# EAGLE design MM4_r0 (EAGLE 6.1)
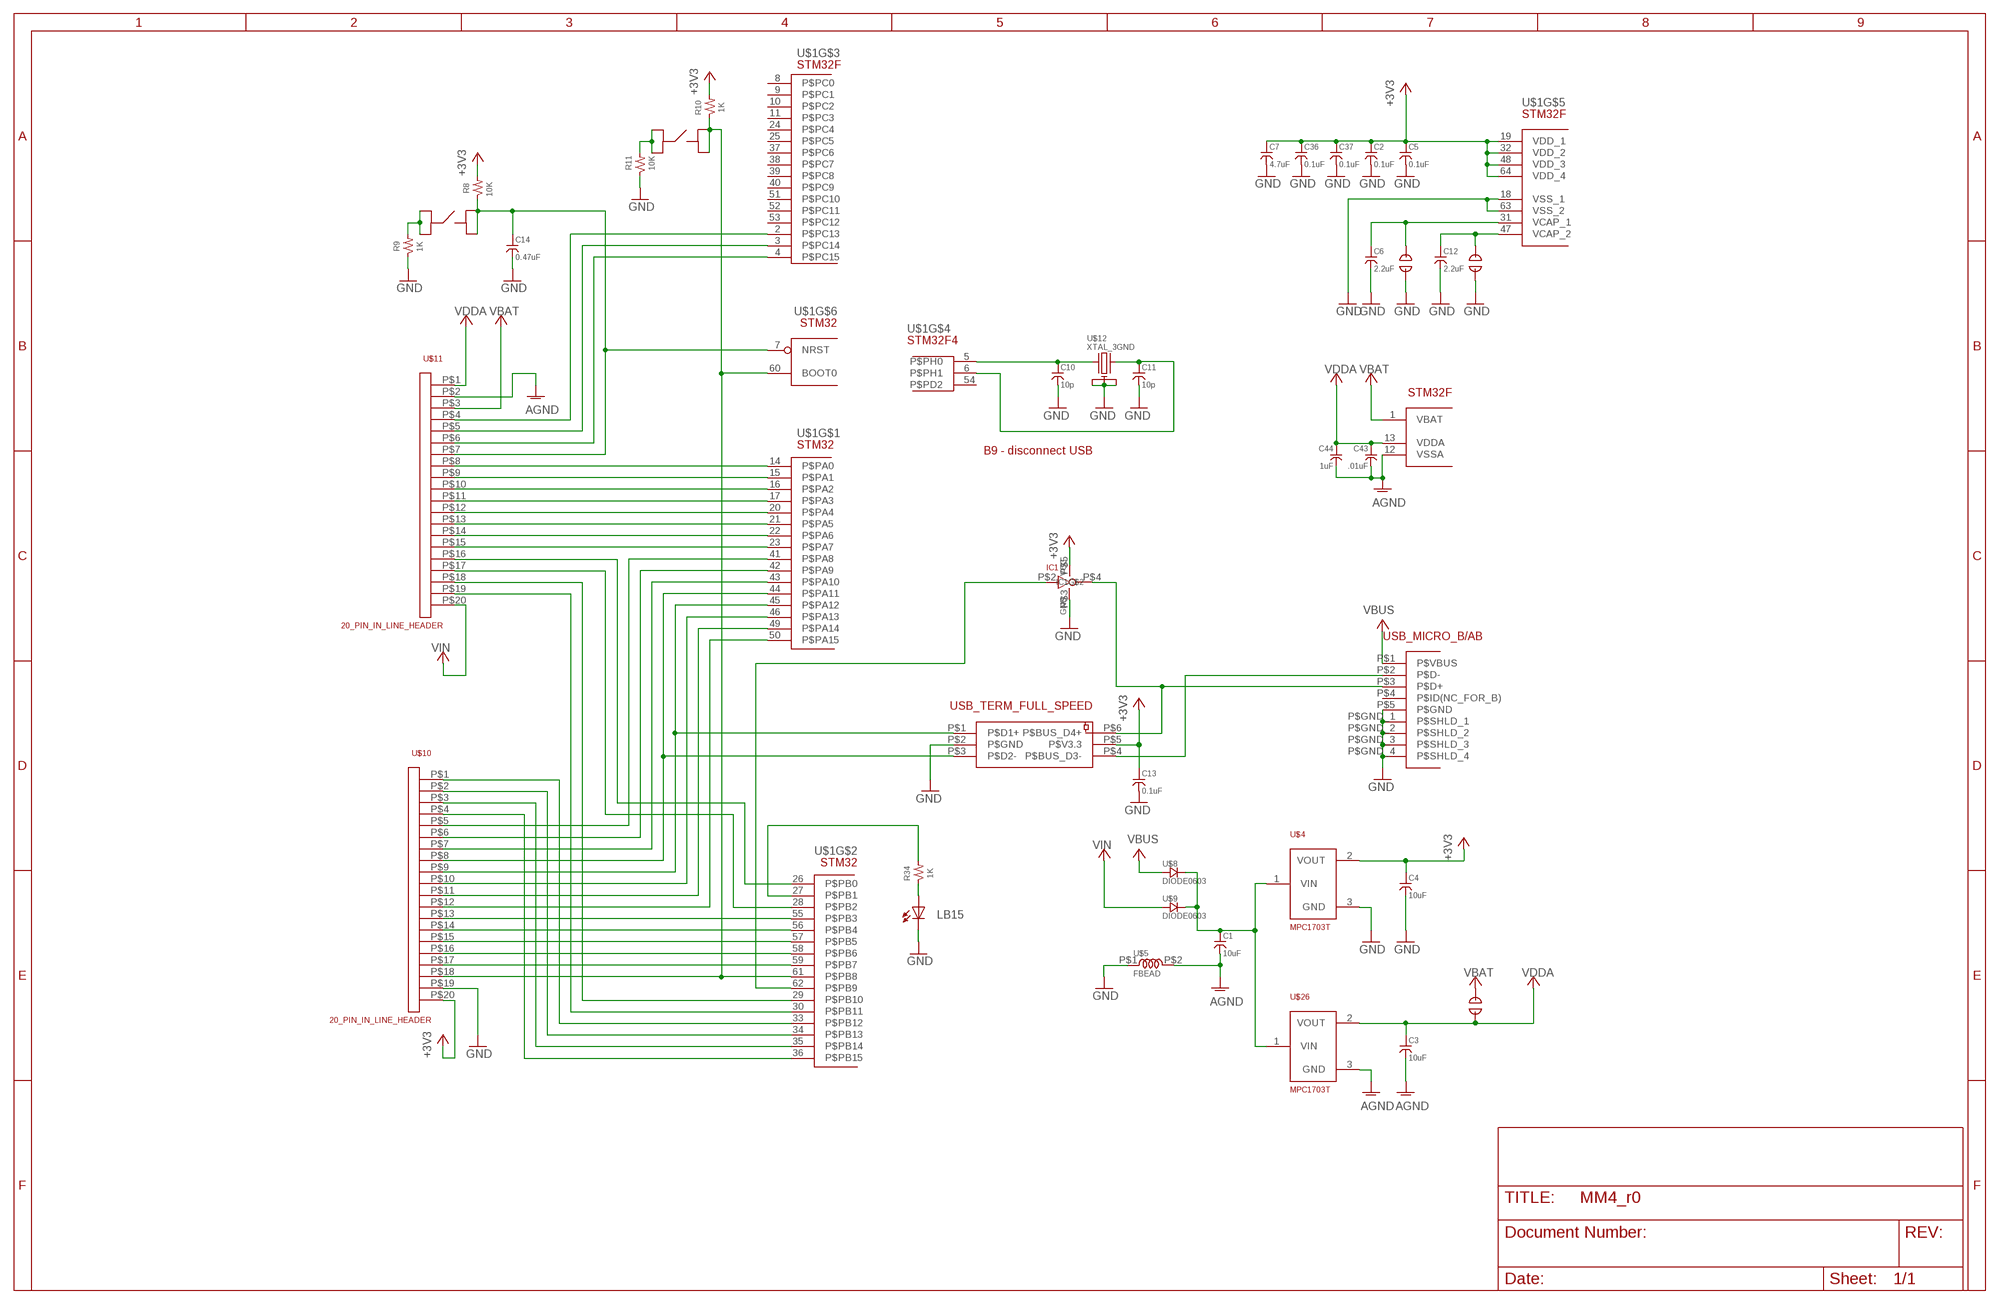
[diagram p0: schematic, sheet 1]

## Parts
C1  10uF  CAP0603  [0603]
C2  0.1uF  CAP0603  [0603]
C3  10uF  CAP0603  [0603]
C4  10uF  CAP0603  [0603]
C5  0.1uF  CAP0603  [0603]
C6  2.2uF  CAP0603  [0603]
C7  4.7uF  CAP0603  [0603]
C10  10p  CAP0603  [0603]
C11  10p  CAP0603  [0603]
C12  2.2uF  CAP0603  [0603]
C13  0.1uF  CAP0603  [0603]
C14  0.47uF  CAP0603  [0603]
C36  0.1uF  CAP0603  [0603]
C37  0.1uF  CAP0603  [0603]
C43  .01uF  CAP0603  [0603]
C44  1uF  CAP0603  [0603]
IC1  7SZ05  LOG_7SZ05  [SC-70-5]
LB15  LED_CMD280603+  [0603+]
R8  10K  RESISTOR0603  [0603]
R9  1K  RESISTOR0603  [0603]
R10  1K  RESISTOR0603  [0603]
R11  10K  RESISTOR0603  [0603]
R34  1K  RESISTOR0603  [0603]
U$1  STM32F40XRG  [TQFP64]
U$2  JUMPER_SOLDER  [JUMPER]
U$3  JUMPER_SOLDER  [JUMPER]
U$4  MPC1703T  [SOT23-3]
U$5  FBEAD  [BEAD_0603]
U$8  DIODE0603  [0603_DIODE]
U$9  DIODE0603  [0603_DIODE]
U$10  20_PIN_IN_LINE_HEADER  [20_PIN_IN_LINE]
U$11  20_PIN_IN_LINE_HEADER  [20_PIN_IN_LINE]
U$12  XTAL_3GND  [XTAL=TXC7M-3]
U$13  JUMPER_SOLDER  [JUMPER]
U$14  MICRO_USB_B  MICRO_USB_BMICRO  [USB-ZX-62-B-5PA]
U$23  USB_TERM_FS  [SOT-666IP]
U$24  SW_SMD_TACTILE  [SW_SMD_TACTILE]
U$25  SW_SMD_TACTILE  [SW_SMD_TACTILE]
U$26  MPC1703T  [SOT23-3]

## Nets
+3V3 [power]: C2.P$1 C4.P$1 C5.P$1 C7.P$1 C13.P$1 C36.P$1 C37.P$1 IC1.P$5(VCC) R8.P$1 R10.P$1 U$1.19(VDD_1) U$1.32(VDD_2) U$1.48(VDD_3) U$1.64(VDD_4) U$4.2(VOUT) U$10.P$20 U$23.P$5(P$V3.3)
AGND [power]: C1.P$2 C3.P$2 C43.P$2 C44.P$2 U$1.12(VSSA) U$5.P$2 U$11.P$2 U$26.3(GND)
GND [power]: C2.P$2 C4.P$2 C5.P$2 C6.P$2 C7.P$2 C10.P$2 C11.P$2 C12.P$2 C13.P$2 C14.P$2 C36.P$2 C37.P$2 IC1.P$3(GND) LB15.P$2-(C) R9.P$2 R11.P$2 U$1.18(VSS_1) U$1.63(VSS_2) U$2.P$1 U$3.P$1 U$4.3(GND) U$5.P$1 U$10.P$19 U$12.GND(P$GND_1) U$12.P$2(P$GND_2) U$12.P$4(P$GND_3) U$14.P$5(P$GND) U$14.P$GND_1(P$SHLD_1) U$14.P$GND_2(P$SHLD_2) U$14.P$GND_3(P$SHLD_3) U$14.P$GND_4(P$SHLD_4) U$23.P$2(P$GND)
N$1: C10.P$1 U$1.5(P$PH0) U$12.P$1(P$XT1)
N$2: LB15.P$1+(A) R34.P$2
N$3: C11.P$1 U$1.6(P$PH1) U$12.P$3(P$XT2)
N$4: U$1.14(P$PA0) U$11.P$8
N$5: U$1.15(P$PA1) U$11.P$9
N$6: U$1.2(P$PC13) U$11.P$4
N$7: R34.P$1 U$1.27(P$PB1)
N$8: U$14.P$2(P$D-) U$23.P$4(P$BUS_D3-)
N$9: U$1.16(P$PA2) U$11.P$10
N$10: U$1.17(P$PA3) U$11.P$11
N$11: U$1.20(P$PA4) U$11.P$12
N$12: U$1.21(P$PA5) U$11.P$13
N$13: U$1.22(P$PA6) U$11.P$14
N$14: U$1.23(P$PA7) U$11.P$15
N$15: U$1.26(P$PB0) U$11.P$16
N$16: U$1.28(P$PB2) U$11.P$17
N$17: U$1.29(P$PB10) U$11.P$18
N$18: IC1.P$4(P$OUT) U$14.P$3(P$D+) U$23.P$6(P$BUS_D4+)
N$20: U$1.30(P$PB11) U$11.P$19
N$21: U$1.33(P$PB12) U$10.P$1
N$22: U$1.34(P$PB13) U$10.P$2
N$23: U$1.35(P$PB14) U$10.P$3
N$24: U$1.36(P$PB15) U$10.P$4
N$25: U$1.41(P$PA8) U$10.P$5
N$26: U$1.42(P$PA9) U$10.P$6
N$27: U$1.43(P$PA10) U$10.P$7
N$28: U$1.44(P$PA11) U$10.P$8 U$23.P$3(P$D2-)
N$29: U$1.45(P$PA12) U$10.P$9 U$23.P$1(P$D1+)
N$30: U$1.46(P$PA13) U$10.P$10
N$31: U$1.49(P$PA14) U$10.P$11
N$32: U$1.50(P$PA15) U$10.P$12
N$33: U$1.55(P$PB3) U$10.P$13
N$34: U$1.56(P$PB4) U$10.P$14
N$35: U$1.57(P$PB5) U$10.P$15
N$36: U$1.58(P$PB6) U$10.P$16
N$37: U$1.59(P$PB7) U$10.P$17
N$38: R10.P$2 U$1.60(BOOT0) U$1.61(P$PB8) U$10.P$18 U$24.P$3 U$24.P$4
N$44: IC1.P$2(P$IN) U$1.62(P$PB9)
N$45: R9.P$1 U$25.P$1 U$25.P$2
N$46: C14.P$1 R8.P$2 U$1.7(NRST) U$11.P$7 U$25.P$3 U$25.P$4
N$47: R11.P$1 U$24.P$1 U$24.P$2
N$48: C1.P$1 U$4.1(VIN) U$8.P$2 U$9.P$2 U$26.1(VIN)
N$49: U$1.3(P$PC14) U$11.P$5
N$50: C6.P$1 U$1.31(VCAP_1) U$2.P$2
N$51: C12.P$1 U$1.47(VCAP_2) U$3.P$2
N$54: U$1.4(P$PC15) U$11.P$6
VBAT: U$1.1(VBAT) U$11.P$3 U$13.P$2
VBUS [power]: U$8.P$1 U$14.P$1(P$VBUS)
VDDA: C3.P$1 C43.P$1 C44.P$1 U$1.13(VDDA) U$11.P$1 U$13.P$1 U$26.2(VOUT)
VIN: U$9.P$1 U$11.P$20
Unconnected: U$1.8(P$PC0) U$1.9(P$PC1) U$1.10(P$PC2) U$1.11(P$PC3) U$1.24(P$PC4) U$1.25(P$PC5) U$1.37(P$PC6) U$1.38(P$PC7) U$1.39(P$PC8) U$1.40(P$PC9) U$1.51(P$PC10) U$1.52(P$PC11) U$1.53(P$PC12) U$1.54(P$PD2) U$14.P$4(P$ID(NC_FOR_B))

## Notes on the sheet
- B9 - disconnect USB

## Library data of the parts
C1-C7 C10-C14 C36 C37 C43 C44 = VAI:CAP: Surface mount caps
IC1 = VAI:LOG_7SZ05
LB15 = VAI:LED_CMD28: SMT Led
R8-R11 R34 = VAI:RESISTOR: SMD Resistor
U$1 = VAI:STM32F40XRG
U$2 U$3 U$13 = VAI:JUMPER_SOLDER
U$4 U$26 = VAI:MPC1703T: LDO voltage regulator 3.3V
U$5 = VAI:FBEAD
U$8 U$9 = VAI:DIODE
U$10 U$11 = VAI:20_PIN_IN_LINE_HEADER
U$12 = VAI:XTAL_3GND
U$14 = VAI:MICRO_USB_B: Micro USB B Connector
U$23 = VAI:USB_TERM_FS
U$24 U$25 = VAI:SW_SMD_TACTILE

## Net classes
0 default: width 0.178 mm, clearance 0.178 mm
1 power: width 0.178 mm, clearance 0.178 mm

## Board
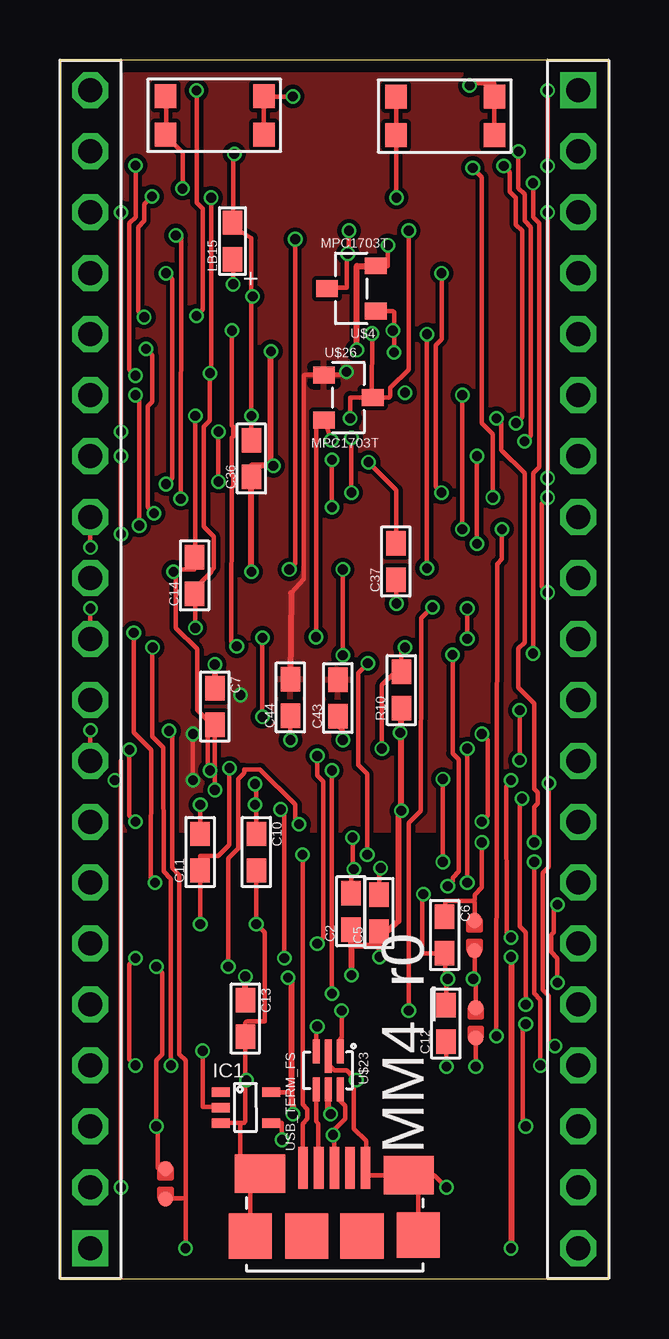
[diagram p1: board, top side]
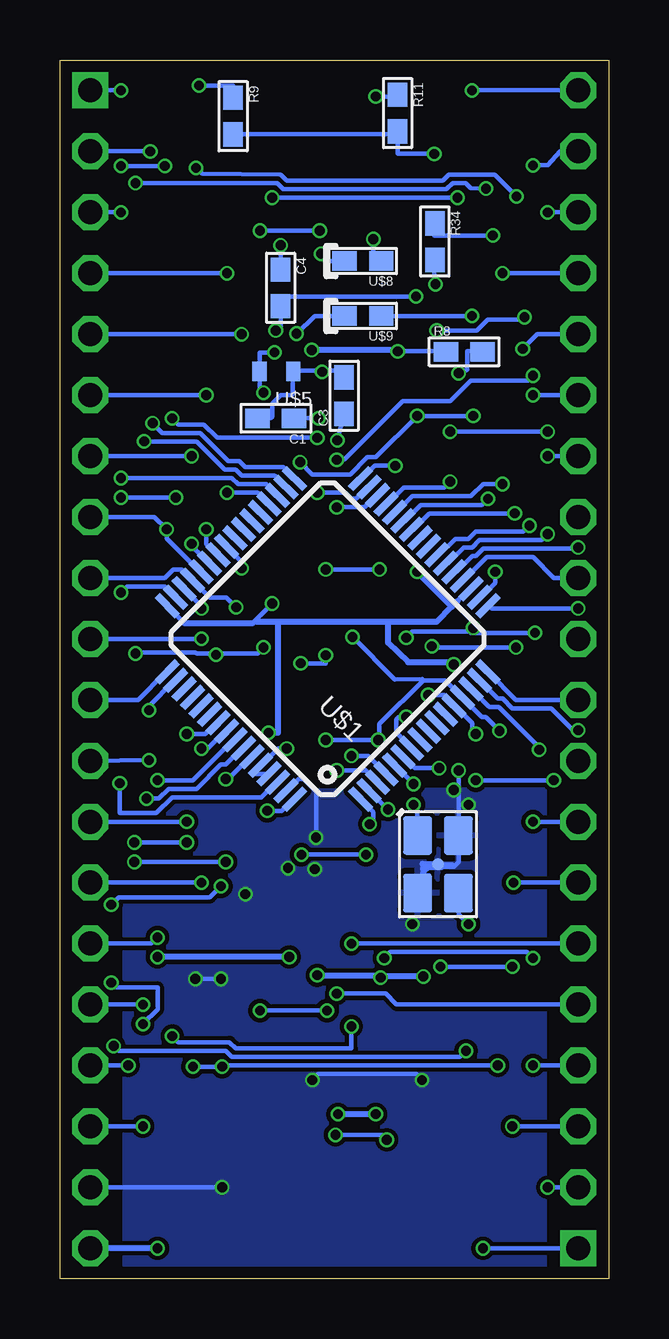
[diagram p2: board, bottom side, seen from below]

Size 22.86 x 50.8 mm. Coordinates in mm from the lower left corner, seen from the top.
Outline: 0,0 22.86,0 22.86,50.8 0,50.8 0,0
Copper layers (1*16): Top 0.035mm / dielectric 1.5mm / Bottom 0.035mm
Design rules: minimum track width 7mil, minimum drill 16mil, track to track 7mil, track to pad 7mil, pad to pad 7mil, via to via 7mil, smd to smd 7mil, copper to edge 20mil, drill to drill 12mil, minimum pad ring 4mil, minimum via ring 4mil, stop-mask expansion 4mil, vias tented up to drill 0mil, thermal gap 10mil

### Footprints (pad centres in the part's own frame; a part is rotated, then mirrored left to right if it is on the bottom)
0603 = smd 1.016 x 0.813: P$1 -0.762,0; P$2 0.762,0
SC-70-5 = smd 0.75 x 0.4: P$1 -1.1,0.65; P$2 -1.1,0; P$3 -1.1,-0.65; P$4 1,-0.65; P$5 1,0.65
0603+ = smd 1.016 x 0.813: P$1+ -0.762,0; P$2- 0.762,0
TQFP64 = smd 1.2 x 0.3: 1 -5.7,3.75; 2 -5.7,3.25; 3 -5.7,2.75; 4 -5.7,2.25; 5 -5.7,1.75; 6 -5.7,1.25; 7 -5.7,0.75; 8 -5.7,0.25; 9 -5.7,-0.25; 10 -5.7,-0.75; 11 -5.7,-1.25; 12 -5.7,-1.75; 13 -5.7,-2.25; 14 -5.7,-2.75; 15 -5.7,-3.25; 16 -5.7,-3.75; 33 5.7,-3.75; 34 5.7,-3.25; 35 5.7,-2.75; 36 5.7,-2.25; 37 5.7,-1.75; 38 5.7,-1.25; 39 5.7,-0.75; 40 5.7,-0.25; 41 5.7,0.25; 42 5.7,0.75; 43 5.7,1.25; 44 5.7,1.75; 45 5.7,2.25; 46 5.7,2.75; 47 5.7,3.25; 48 5.7,3.75 | smd 0.3 x 1.2: 17 -3.75,-5.7; 18 -3.25,-5.7; 19 -2.75,-5.7; 20 -2.25,-5.7; 21 -1.75,-5.7; 22 -1.25,-5.7; 23 -0.75,-5.7; 24 -0.25,-5.7; 25 0.25,-5.7; 26 0.75,-5.7; 27 1.25,-5.7; 28 1.75,-5.7; 29 2.25,-5.7; 30 2.75,-5.7; 31 3.25,-5.7; 32 3.75,-5.7; 49 3.75,5.7; 50 3.25,5.7; 51 2.75,5.7; 52 2.25,5.7; 53 1.75,5.7; 54 1.25,5.7; 55 0.75,5.7; 56 0.25,5.7; 57 -0.25,5.7; 58 -0.75,5.7; 59 -1.25,5.7; 60 -1.75,5.7; 61 -2.25,5.7; 62 -2.75,5.7; 63 -3.25,5.7; 64 -3.75,5.7
JUMPER = smd 0.635 x 0.635: P$1 -0.635,0; P$2 0.635,0
SOT23-3 = smd 0.9 x 0.7: 1 1.016,0; 2 -1.016,-0.94; 3 -1.016,0.94
BEAD_0603 = smd 0.6 x 0.8: P$1 0.7,0; P$2 -0.7,0
0603_DIODE = smd 1.016 x 0.813: P$1 -0.762,0; P$2 0.762,0
20_PIN_IN_LINE = drill 1 square: P$1 0,24.13 | drill 1 octagon: P$2 0,21.59; P$3 0,19.05; P$4 0,16.51; P$5 0,13.97; P$6 0,11.43; P$7 0,8.89; P$8 0,6.35; P$9 0,3.81; P$10 0,1.27; P$11 0,-1.27; P$12 0,-3.81; P$13 0,-6.35; P$14 0,-8.89; P$15 0,-11.43; P$16 0,-13.97; P$17 0,-16.51; P$18 0,-19.05; P$19 0,-21.59; P$20 0,-24.13
XTAL=TXC7M-3 = smd 0.5 x 0.5 rotated 146.3: GND 0,0 | smd 1.6 x 1.2: P$1 -1.2,-0.85; P$2 1.2,-0.85; P$3 1.2,0.85; P$4 -1.2,0.85
USB-ZX-62-B-5PA = smd 0.4 x 1.75 bottom: P$1 1.3,2.85; P$2 0.65,2.85; P$3 0,2.85; P$4 -0.65,2.85; P$5 -1.3,2.85 | smd 1.8 x 1.9 bottom: P$GND_1 3.5,0; P$GND_2 -3.5,0.05; P$NC_1 1.15,0; P$NC_2 -1.15,0 | smd 2.1 x 1.6 bottom: P$GND_3 3.1,2.6; P$GND_4 -3.1,2.55
SOT-666IP = smd 0.3 x 1: P$1 -0.5,-0.8; P$3 0.5,-0.8; P$4 0.5,0.8; P$5 0,0.8; P$6 -0.5,0.8 | smd 0.3 x 1.4: P$2 0,-0.6
SW_SMD_TACTILE = smd 0.9 x 1: P$1 2.05,0.8; P$2 2.05,-0.8; P$3 -2.05,0.8; P$4 -2.05,-0.8

### Placement (x,y rotation side)
C1  13.87,35.86 180 bottom
C2  12.12,15.32 90 top
C3  11.02,36.8 90 bottom
C4  13.67,41.3 270 bottom
C5  13.28,15.24 90 top
C6  16.03,14.33 270 top
C7  6.45,23.85 270 top
C10  8.18,17.78 270 top
C11  5.84,17.78 90 top
C12  16.08,10.64 90 top
C13  7.72,10.85 270 top
C14  5.61,29.31 90 top
C36  7.98,34.19 90 top
C37  14,29.9 90 top
C43  11.58,24.21 90 top
C44  9.6,24.23 90 top
IC1  7.8,7.14 0 top
LB15  7.19,43.26 90 top
R8  6.02,38.63 0 bottom
R9  15.65,48.46 270 bottom
R10  14.22,24.54 90 top
R11  8.79,48.59 270 bottom
R34  7.24,43.23 270 bottom
U$1  11.71,26.67 135 bottom
U$2  17.27,14.3 90 top
U$3  17.32,10.67 270 top
U$4  12.14,41.27 180 top
U$5  13.84,37.82 180 bottom
U$8  10.24,42.42 180 bottom
U$9  10.24,40.13 180 bottom
U$10  21.59,25.4 0 top
U$11  1.27,25.4 180 top
U$12  7.11,17.27 270 bottom
U$13  4.39,3.96 90 top
U$14  11.43,1.78 0 bottom
U$23  11.18,8.69 180 top
U$24  6.45,48.49 0 top
U$25  16.05,48.46 0 top
U$26  12.01,36.73 0 top

### Tracks (layer width: path | path; a pad name or v marks a point on that pad's centre or on a via)
+3V3  (via drill 0.41)
  Top 0.178: U$4.2 13.67,42.22 v13.67,43.08 | 7.98,33.88 C36.P$1 | 8.79,33.93 v8.89,33.88 | 13.74,14.58 13.69,14.53 | 13.31,14.53 C5.P$1 13.31,14.43 13.31,13.87 | v14.02,28.14 14.02,29.11 C37.P$1 | v14.17,22.76 14.22,22.76 | 12.14,13.92 12.19,13.87 12.14,13.82 | 12.14,14.53 C2.P$1 | 9.63,7.77 8.84,7.77 IC1.P$5
  Top 0.254: v8.89,33.88 7.98,33.88 | 8.79,33.93 v8.79,38.66 | U$4.2 12.37,42.22 v12.37,38.71 | R10.P$1 14.22,22.76 v14.22,19.51 14.1,19.28 14.1,14.91 13.74,14.58 | 13.69,14.53 13.31,14.53 | v6.45,25.6 C7.P$1 | v7.98,29.46 C36.P$1 | 12.14,13.92 12.14,14.53 | 12.19,13.87 13.31,13.87 v13.31,13.41 | v9.5,12.55 9.63,12.39 9.63,7.77 9.63,7.32 9.7,7.21 v9.7,6.86 | C13.P$1 v7.72,12.6 | U$23.P$5 11.18,7.09 11.3,6.86 v11.28,6.86 | v18.8,13.41 v18.8,1.27 | 12.14,13.82 v12.14,12.65
  Bottom 0.178: C4.P$1 v13.67,43.08 | v8.89,33.88 9.75,33.88 10.26,33.38 10.31,33.38 U$1.32 | R8.P$1 6.81,38.66 v8.79,38.66 8.84,38.71 | v14.22,19.51 13.61,19.51 13.16,19.96 13.11,19.96 U$1.64 | 14.83,27.33 14.73,27.43 | 14.73,27.43 v14.02,28.14 | 17.68,27.33 U$1.48 | 6.3,28.25 5.79,28.75 U$1.19 | 14.68,27.38 14.73,27.43 | 9.45,12.6 v9.5,12.55 9.5,12.65
  Bottom 0.254: 8.84,38.71 v12.37,38.71 | 17.68,27.33 14.83,27.33 | v6.45,25.6 6.55,25.7 8.36,25.7 9.2,26.52 9.2,27.38 | 9.2,27.38 7.16,27.38 6.53,28.02 | 6.3,28.25 6.53,28.02 | 9.2,27.38 13.77,27.38 | 13.77,27.38 14.68,27.38 | 6.53,28.02 v7.98,29.46 | 13.77,27.38 13.77,22.76 v14.17,22.76 | v7.72,12.6 9.45,12.6 | v9.7,6.86 v11.28,6.86 | v18.8,1.27 U$10.P$20 | v13.31,13.41 v18.8,13.41 | v12.14,12.65 9.5,12.65
AGND  (via drill 0.41)
  Top 0.178: v11.94,37.8 11.94,37.69 11.02,37.69 U$26.3 10.92,37.69 10.21,37.69 10.16,37.64 10.16,29.16 9.63,28.57 | 2.54,21.59 2.54,20.78 | 2.54,20.78 v2.54,3.81 | v2.29,20.78 2.54,20.78 | v5.54,22.71 v5.54,20.78
  Top 0.254: 9.63,28.57 C44.P$2
  Bottom 0.178: v7.52,24.33 6.86,24.33 6.45,23.93 U$1.12 6.4,23.82 6.35,23.82 5.69,23.16 5.69,22.86 v5.54,22.71 | 11.94,37.85 11.02,37.85 C3.P$2 | 11.94,37.85 13.11,37.85 U$5.P$2 13.16,37.74 13.16,36.88 13.21,36.83 13.67,36.83 14.02,36.47 14.02,35.92 14.07,35.87 C1.P$2 | v11.94,37.8 11.94,37.85 | v2.54,3.81 U$11.P$2 | v5.54,20.78 v2.29,20.78
  pour Top: 2.59,50.83 2.64,18.69 20.5,18.69 20.47,50.77
GND  (via drill 0.41)
  Top 0.178: 13.92,39.52 13.92,40.28 13.87,40.34 U$4.3 | 13.92,39.52 v13.92,38.61 | v13.87,39.52 13.92,39.52 | C36.P$2 v7.98,35.97 7.98,40.95 | v5.64,35.97 5.64,30.12 C14.P$2 5.64,30.07 5.64,29.62 5.59,29.57 4.72,29.57 v4.72,29.46 4.83,29.52 4.83,27.13 5.71,26.24 5.71,23.7 6.15,23.27 6.15,21.29 v6.25,21.18 | 7.98,40.95 7.98,43.38 7.29,43.81 7.21,43.87 7.21,43.94 LB15.P$2- 7.21,44.04 7.21,46.79 7.26,46.84 v7.26,46.89 | v8.03,40.95 7.98,40.95 | 16.1,12.39 16.05,12.45 16.05,13.56 C6.P$2 15.09,13.56 15.09,16.03 v15.14,16.03 | 16.1,12.39 16.1,11.43 C12.P$2 | U$3.P$1 17.32,12.5 17.27,12.55 | U$2.P$1 17.27,12.55 | v16.15,12.5 16.15,12.45 16.1,12.39 | v17.22,12.5 17.27,12.55 | C11.P$2 v5.84,19.76 | C10.P$2 v8.18,14.78 8.53,14.43 8.53,10.72 7.77,10.72 7.72,10.67 C13.P$2 7.72,8.28 | v6.45,20.37 C7.P$2 | C2.P$2 12.14,16.1 12.14,16.97 v12.24,17.07 12.19,17.12 v12.19,18.39 | v13.36,17.12 13.31,17.07 13.31,16 C5.P$2 | v12.85,34.04 14.02,32.87 14.02,30.68 C37.P$2 | 6.71,6.5 IC1.P$3 6.76,6.5 7.52,6.5 | 7.52,6.5 7.52,4.42 7.57,4.37 8.28,4.37 U$14.P$GND_3 7.93,4.32 U$14.P$GND_1 | 7.72,8.28 7.72,6.55 7.67,6.5 7.52,6.5 | U$23.P$2 11.18,8.94 11.43,8.69 11.94,8.69 12.24,8.38 12.24,8.28 | 12.24,8.28 12.24,6.25 12.75,5.74 12.75,4.67 U$14.P$5 12.75,4.57 12.75,4.32 14.48,4.32 U$14.P$GND_4 | v16.1,3.81 15.6,4.32 14.58,4.32 U$14.P$GND_4 | U$14.P$GND_2 14.93,4.27 U$14.P$GND_4 | v7.77,8.28 7.72,8.28 | v12.34,8.28 12.24,8.28
  Bottom 0.178: v13.92,38.61 14.53,38.61 14.53,37.85 U$5.P$1 14.53,37.74 14.53,36.98 14.48,36.93 v14.38,36.93 | v13.87,39.52 13.67,39.52 C4.P$2 13.67,40.95 v8.03,40.95 | v4.72,29.46 4.72,29.01 5.28,28.45 5.33,28.45 U$1.18 | v5.64,35.97 v7.98,35.97 9.7,34.24 10.06,34.24 10.77,33.53 12.34,33.53 v12.85,34.04 | v17.22,12.5 v16.15,12.5 | U$12.GND 6.6,17.27 6.52,17.27 | v6.45,20.37 6.45,20.32 | U$12.P$4 6.3,18.49 6.35,18.56 | v6.25,21.18 6.25,18.59 6.2,18.54 6.15,18.54 6.15,18.44 6.25,18.34 6.25,17.37 6.45,17.17 6.91,17.17 6.96,17.12 7.52,17.12 7.57,17.07 7.72,17.07 7.72,17.12 7.77,17.12 7.77,17.07 7.67,16.97 7.72,16.92 7.77,16.92 7.77,16.87 7.72,16.87 7.67,16.82 7.47,16.82 7.47,16.31 7.62,16.15 7.67,16.15 7.67,16.1 7.57,16.1 7.52,16.15 7.47,16.15 7.47,16.05 7.52,16 7.57,16 7.62,15.95 7.67,15.95 7.67,15.85 7.72,15.8 7.77,15.8 7.77,15.85 7.72,15.85 7.72,15.9 7.77,15.9 7.77,15.95 7.72,15.95 7.72,16 7.77,16 7.77,16.05 7.52,16.05 7.52,16.1 7.62,16.2 7.67,16.2 7.67,16.31 7.72,16.36 7.77,16.36 7.77,16.31 7.72,16.31 7.72,16.26 7.77,16.26 7.77,16.2 7.72,16.2 7.72,16.15 7.82,16.15 U$12.P$2 7.93,16.1 7.87,16.1 | v15.14,16.03 15.11,16.05 | v7.26,46.89 8.79,46.89 R11.P$2 8.84,47.7 R9.P$2 | v16.1,3.81 U$10.P$19 | v7.77,8.28 8.03,8.53 12.09,8.53 v12.34,8.28 | v12.19,18.39 12.19,20.32 12.7,20.83 12.9,20.83 13.36,20.37 13.41,20.37 U$1.63
  Bottom 0.254: U$12.GND 7.75,17.27 7.75,17.3
  pour Bottom: 2.67,20.42 2.67,0.13 20.17,0.03 20.17,20.32
N$1  (via drill 0.41)
  Top 0.178: 8.18,19.76 8.18,20.57 v8.13,20.62 | 8.18,19.76 C10.P$1 | v8.13,19.76 8.18,19.76
  Bottom 0.178: v8.13,20.62 8.89,21.39 U$1.5 | v8.13,19.76 7.98,19.61 7.98,18.49 U$12.P$1
N$2  (via drill 0.41)
  Top 0.178: v7.21,41.45 7.21,42.47 LB15.P$1+
  Bottom 0.178: v7.21,41.45 7.26,41.45 7.26,42.47 R34.P$2
N$3  (via drill 0.41)
  Top 0.178: v5.84,14.78 C11.P$1 5.84,17.63 6.6,17.63 7.06,18.09 v7.06,21.29
  Bottom 0.178: v5.84,14.78 6.25,15.19 6.25,16.05 U$12.P$3 | v7.06,21.29 8.08,21.29 8.53,21.74 U$1.6
N$4  (via drill 0.41)
  Top 0.178: v2.9,22.05 2.9,19.3 v3.15,19.05
  Bottom 0.178: v2.9,22.05 2.9,22.15 4.57,23.82 4.98,23.82 5.69,24.54 U$1.14 | U$11.P$8 v3.15,19.05
N$5  (via drill 0.41)
  Top 0.178: U$11.P$9 v1.27,22.86
  Bottom 0.178: v1.27,22.86 1.47,22.86 2.39,23.77 4.01,23.77 4.42,24.18 4.62,24.18 5.33,24.89 U$1.15
N$6  (via drill 0.41)
  Top 0.178: v9.2,19.56 9.35,19.41 v9.35,13.36 | v3.15,13.36 2.9,13.11 2.9,9.14 v3.15,8.89
  Bottom 0.178: v9.2,19.56 9.96,20.32 U$1.2 | v9.35,13.36 9.09,13.61 3.4,13.61 v3.15,13.36 | U$11.P$4 v3.15,8.89
N$7  (via drill 0.41)
  Top 0.178: v5.03,32.51 5.05,43.1 5.05,43.48 v4.83,43.48
  Bottom 0.178: v4.83,43.48 7.26,43.48 7.26,43.99 R34.P$1 | v5.03,32.51 5.28,32.26 7.82,32.26 8.48,31.6 8.53,31.6 U$1.27
N$8
  Top 0.178: U$14.P$2 10.77,4.67 10.77,6.45 10.67,6.55 10.67,7.87 U$23.P$4
N$9
  Bottom 0.178: U$11.P$10 3.86,24.13 4.98,25.25 U$1.16
N$10  (via drill 0.41)
  Top 0.178: U$11.P$11 v1.27,27.94
  Bottom 0.178: v1.27,27.94 4.88,27.94 4.98,28.04 U$1.17
N$11
  Bottom 0.178: U$11.P$12 2.29,29.21 3.15,30.07 5.08,30.07 5.99,29.16 6.04,29.16 U$1.20
N$12  (via drill 0.41)
  Top 0.178: U$11.P$13 v1.27,30.48
  Bottom 0.178: v1.27,30.48 1.32,30.43 5.23,30.43 5.54,30.12 5.69,30.12 6.35,29.46 6.4,29.46 U$1.21
N$13  (via drill 0.41)
  Top 0.178: v2.54,34.29 v2.54,31.04
  Bottom 0.178: v2.54,31.04 2.79,30.79 5.38,30.79 5.69,30.48 6.04,30.48 6.71,29.82 6.76,29.82 U$1.22 | U$11.P$14 v2.54,34.29
N$14  (via drill 0.41)
  Top 0.178: v3.15,36.83 3.3,36.83 v3.3,31.39
  Bottom 0.178: v3.3,31.39 3.56,31.14 5.54,31.14 5.84,30.84 6.4,30.84 7.06,30.18 7.11,30.18 U$1.23 | U$11.P$15 v3.15,36.83
N$15  (via drill 0.41)
  Top 0.178: v3.91,31.9 3.66,32.16 3.66,36.37 3.84,36.55 3.84,38.51 v3.58,38.76
  Bottom 0.178: v3.91,31.9 7.47,31.9 8.13,31.24 8.18,31.24 U$1.26 | U$11.P$16 2.97,39.37 v3.58,38.76
N$16  (via drill 0.41)
  Top 0.178: v4.42,33.12 4.67,33.38 4.67,41.66 v4.42,41.91
  Bottom 0.178: v4.42,33.12 5.23,33.12 5.74,32.61 8.18,32.61 8.84,31.95 8.89,31.95 U$1.28 | U$11.P$17 v4.42,41.91
N$17  (via drill 0.41)
  Top 0.178: v6.6,35.31 v6.6,33.22 | v2.54,44.45 v2.54,35.31
  Bottom 0.178: v6.6,33.22 6.86,32.97 8.53,32.97 9.2,32.31 9.25,32.31 U$1.29 | v2.54,35.31 v6.6,35.31 | U$11.P$18 v2.54,44.45
N$18  (via drill 0.41)
  Top 0.178: 11.43,5.99 11.43,6.2 11.89,6.66 11.89,7.21 11.68,7.42 11.68,7.87 U$23.P$6 | 11.43,5.99 U$14.P$3 | v9.25,5.79 9.25,6.5 8.84,6.5 IC1.P$4 | v11.38,5.99 11.43,5.99
  Bottom 0.178: v9.25,5.79 9.45,5.99 v11.38,5.99
N$20  (via drill 0.41)
  Top 0.178: v3.15,46.41 3.15,44.25 2.9,43.99 2.9,37.9 v3.15,37.64 | v11.33,32.16 v11.33,34.14
  Bottom 0.178: v3.15,46.41 2.54,46.41 2.01,46.99 U$11.P$19 | v3.15,37.64 3.35,37.44 5.74,37.44 6.6,36.58 8.59,36.58 11.02,34.14 v11.33,34.14 | v11.33,32.16 10.16,32.16 9.7,32.61 9.65,32.61 U$1.30
N$21  (via drill 0.41)
  Top 0.178: v19,35.66 19.25,35.92 19.25,43.69 19,43.94 19,45.06 18.75,45.31 18.75,46.13 v18.49,46.38 | v20.32,49.53 v20.32,46.38
  Bottom 0.178: v19,35.66 18.59,35.26 17.02,35.26 15.85,34.09 15.39,34.09 15.14,33.83 13.56,33.83 13.11,33.38 U$1.33 | v20.32,46.38 v18.49,46.38 | U$10.P$1 v20.32,49.53
N$22  (via drill 0.41)
  Top 0.178: v19.36,34.9 19.61,35.15 19.61,43.84 19.36,44.09 19.36,45.21 19.1,45.47 v19.1,46.99
  Bottom 0.178: v19.36,34.9 17.17,34.9 16,33.73 15.55,33.73 15.29,33.48 13.92,33.48 13.46,33.02 U$1.34 | U$10.P$2 v19.1,46.99
N$23  (via drill 0.41)
  Top 0.178: v20.32,44.45 v20.32,33.38
  Bottom 0.178: v20.32,33.38 15.7,33.38 15.44,33.12 14.28,33.12 13.82,32.66 U$1.35 | U$10.P$3 v20.32,44.45
N$24  (via drill 0.41)
  Top 0.178: v15.9,32.77 15.65,33.02 15.65,38.91 15.9,39.17 v15.9,41.91
  Bottom 0.178: v15.9,32.77 14.63,32.77 14.17,32.31 U$1.36 | U$10.P$4 v15.9,41.91
N$25  (via drill 0.41)
  Top 0.178: v15.29,39.37 v15.29,29.62
  Bottom 0.178: v15.29,29.62 15.29,29.87 15.9,30.48 U$1.41 | U$10.P$5 v15.29,39.37
N$26  (via drill 0.41)
  Top 0.178: v16.76,36.83 v16.76,31.24
  Bottom 0.178: v16.76,31.24 16.76,30.63 16.31,30.18 U$1.42 | U$10.P$6 v16.76,36.83
N$27  (via drill 0.41)
  Top 0.178: v17.37,34.29 v17.37,30.63
  Bottom 0.178: v17.37,30.63 17.37,30.53 16.66,29.82 U$1.43 | U$10.P$7 v17.37,34.29
N$28  (via drill 0.41)
  Top 0.178: v10.72,10.52 10.67,10.46 10.67,9.5 U$23.P$3 | v18.41,31.24 18.41,30 18.21,29.79 v18.19,10.11
  Bottom 0.178: U$1.44 17.02,29.46 18.41,30.86 v18.41,31.24 18.92,31.75 U$10.P$8 | v10.72,10.52 10.72,9.6 15.55,9.6 15.8,9.86 17.93,9.86 v18.19,10.11
N$29  (via drill 0.41)
  Top 0.178: v15.52,27.99 15.06,27.53 15.06,27.08 15.04,19.51 14.53,19 v14.53,11.18 | v11.74,11.18 11.74,10.06 11.68,10.01 U$23.P$1
  Bottom 0.178: U$10.P$9 18.49,29.21 18.14,29.57 17.78,29.57 17.37,29.16 U$1.45 17.27,29.06 16.61,28.4 15.93,28.4 v15.52,27.99 | v14.53,11.18 v11.74,11.18
N$30  (via drill 0.41)
  Top 0.178: v16.97,26.67 v16.97,27.94
  Bottom 0.178: v16.97,27.94 16.97,28.04 U$1.46 | U$10.P$10 v16.97,26.67
N$31
  Bottom 0.178: U$10.P$11 19.61,24.13 18.49,25.25 18.44,25.25 U$1.49
N$32  (via drill 0.41)
  Top 0.178: v19.15,21.61 v19.15,23.7
  Bottom 0.178: v19.15,23.7 19.15,23.88 18.14,24.89 18.09,24.89 U$1.50 | U$10.P$12 v19.15,21.61
N$33  (via drill 0.41)
  Top 0.178: v17.58,22.71 17.83,22.45 17.83,19.3 v17.58,19.05
  Bottom 0.178: v17.58,22.71 16.82,22.71 16.36,23.16 16.31,23.16 U$1.55 | U$10.P$13 v17.58,19.05
N$34  (via drill 0.41)
  Top 0.178: v16.97,16.51 v16.97,22.1
  Bottom 0.178: v16.97,22.1 16.71,22.1 16,22.81 15.95,22.81 U$1.56 | U$10.P$14 v16.97,16.51
N$35  (via drill 0.41)
  Top 0.178: v18.8,20.78 18.59,20.52 18.62,14.4 v18.8,14.22
  Bottom 0.178: v18.8,20.78 17.32,20.78 15.65,22.45 15.6,22.45 U$1.57 | v18.8,14.22 19.05,13.97 U$10.P$15
N$36  (via drill 0.41)
  Top 0.178: v19.25,20.02 19.15,19.94 19.15,14.68 19.41,14.43 v19.41,11.43
  Bottom 0.178: v19.25,20.02 18.75,20.02 18.34,20.42 17.17,20.42 16.15,21.44 15.95,21.44 15.29,22.1 15.24,22.1 U$1.58 | U$10.P$16 v19.41,11.43
N$37  (via drill 0.41)
  Top 0.178: v15.95,17.37 v15.95,20.83 | v19.76,17.37 19.76,11.89 20.02,11.63 v20.02,8.89
  Bottom 0.178: v15.95,20.83 15.85,20.83 14.93,21.74 14.88,21.74 U$1.59 | v19.76,17.37 v15.95,17.37 | U$10.P$17 v20.02,8.89
N$38  (via drill 0.41)
  Top 0.178: U$24.P$3 4.42,49.28 4.42,47.7 U$24.P$4 4.42,47.6 5.11,46.94 v5.11,45.44 | v13.41,22.1 13.41,24.74 13.95,25.27 R10.P$2 14.22,26.16 v14.38,26.31 | v19.71,45.67 19.71,44.25 19.96,43.99 19.96,33.83 19.71,33.58 v19.71,26.06 | v19.41,6.35 19.28,6.5 19.28,10.49 v19.41,10.62 | v20.73,12.34 20.73,13.36 20.47,13.61 20.47,14.33 20.57,14.43 20.57,15.44 v20.73,15.6 | v16.15,16.36 16.36,16.56 16.36,16.71 16.61,16.97 16.61,21.64 16.36,21.89 v16.36,26.01
  Bottom 0.178: v13.41,22.1 13.77,22.1 14.43,21.44 14.48,21.44 U$1.60 14.58,21.39 14.88,21.08 14.83,21.03 14.17,21.03 U$1.61 | v5.11,45.44 5.74,45.47 5.94,45.67 6.5,45.67 6.76,45.41 13.56,45.41 13.82,45.67 v19.71,45.67 | v19.71,26.06 19.66,26.11 17.22,26.11 17.17,26.06 16.36,26.06 | 16.36,26.06 14.63,26.06 v14.38,26.31 | v19.41,6.35 U$10.P$18 | v19.41,10.62 18.8,11.23 18.8,12.14 20.52,12.14 v20.73,12.34 | v20.73,15.6 20.42,15.9 16.61,15.9 v16.15,16.36 | v16.36,26.01 16.36,26.06
N$44  (via drill 0.41)
  Top 0.178: v20.62,9.7 20.37,9.96 20.37,11.79 20.12,12.04 20.12,16.92 20.37,17.17 v20.37,20.65 | v5.94,9.5 5.94,7.16 6.65,7.16 IC1.P$2
  Bottom 0.178: 20.47,9.55 v20.62,9.7 20.42,9.5 15.95,9.5 15.7,9.25 6.2,9.25 v5.94,9.5 | v20.37,20.65 20.37,19.41 18.85,19.41 18.19,20.07 14.48,20.07 13.87,20.68 13.82,20.68 U$1.62
N$45  (via drill 0.41)
  Top 0.178: U$25.P$2 18.09,47.7 18.09,49.23 U$25.P$1 18.09,49.33 18.09,49.84 17.12,49.84 17.07,49.78 v17.07,49.73
  Bottom 0.178: R9.P$1 15.65,49.73 v17.07,49.73
N$46  (via drill 0.41)
  Top 0.178: U$25.P$3 14.02,49.23 14.02,47.7 U$25.P$4 14.02,47.6 v14.02,45.06 | v8.43,26.72 v8.43,23.42 | v5.64,27.13 5.64,28.5 C14.P$1 5.64,28.55 5.64,28.88 5.71,28.88 6.3,29.46 6.3,29.52 6.4,29.62 6.4,30.94 5.99,31.34 5.99,35.51 6.25,35.76 v6.25,37.74 6.3,37.8 v6.3,45.06 | v3.07,26.92 3.07,22.76 3.81,22.05 3.78,16.66 v3.96,16.51
  Bottom 0.178: v6.25,37.74 6.15,37.85 5.94,37.85 5.89,37.9 5.89,38.66 5.28,38.66 R8.P$2 | v8.43,23.42 8.74,23.42 8.84,23.32 8.84,22.76 8.23,22.15 U$1.7 | v8.43,26.72 8.18,26.98 5.79,26.98 v5.64,27.13 5.74,26.92 v3.07,26.92 | v6.3,45.06 v14.02,45.06 | v3.96,16.51 U$11.P$7
N$47  (via drill 0.41)
  Top 0.178: U$24.P$2 8.48,47.7 8.48,49.28 U$24.P$1 8.59,49.28 v9.7,49.28
  Bottom 0.178: R11.P$1 8.79,49.28 v9.7,49.28
N$48  (via drill 0.41)
  Top 0.178: U$4.1 11.12,41.3 11.94,41.3 11.94,42.67 v11.99,42.72 12.04,42.77 v12.04,43.69 | U$26.1 12.09,36.73 v12.09,35.87 | v13.01,39.4 12.98,36.78 U$26.1 | v14.53,43.69 14.53,37.9 13.77,37.13 13.77,36.78 13.72,36.73 U$26.1
  Bottom 0.178: v11.99,42.72 11.68,42.42 U$8.P$2 | C1.P$1 v12.09,35.87 | U$9.P$2 12.24,40.13 v13.01,39.4 | v14.53,43.69 v12.04,43.69
N$49  (via drill 0.41)
  Top 0.178: v11.33,21.18 v11.33,11.89
  Bottom 0.178: U$11.P$5 8.84,11.43 9.3,11.89 v11.33,11.89 | v11.33,21.18 10.21,21.18 10.16,21.23 9.65,20.73 U$1.3
N$50  (via drill 0.41)
  Top 0.178: U$2.P$2 17.27,15.7 17.22,15.75 | 17.22,15.75 16.05,15.75 16.05,15.09 C6.P$1 | v12.14,35.05 v12.14,32.77 | v18.19,35.87 18.39,35.66 18.39,34.54 19.36,33.58 19.36,26.52 19.1,26.26 19.1,24.64 19.76,23.98 19.76,20.42 19.91,20.27 19.91,19.81 19.76,19.66 v19.76,18.19 | v17.58,18.19 17.58,16.31 17.27,16 17.27,15.8 17.22,15.75
  Bottom 0.178: v12.14,32.77 10.97,32.77 10.72,32.51 10.52,32.51 10.06,32.97 10.01,32.97 U$1.31 | v12.14,35.05 16.31,35.05 16.87,35.61 17.93,35.61 v18.19,35.87 | v17.58,18.19 v19.76,18.19
N$51  (via drill 0.41)
  Top 0.178: v20.32,28.6 20.07,28.85 20.07,32.31 v20.32,32.56 | v18.03,32.56 18.03,35.2 17.58,35.66 17.58,45.92 v17.2,46.3 | v3.84,45.11 3.51,44.78 3.51,44.09 3.25,43.84 3.25,40.34 v3.51,40.08 | v7.16,39.52 7.16,35.56 7.21,35.51 7.21,35.1 7.16,35.05 7.16,33.48 7.21,33.43 7.21,33.02 7.16,32.97 7.14,26.77 7.14,26.57 v7.37,26.36 | v3.86,26.31 3.86,26.16 3.84,26.06 3.84,22.61 4.29,22.15 4.32,16.97 4.62,16.66 v4.62,8.89 | v16.1,8.84 16.1,9.86 C12.P$1 | U$3.P$2 v17.32,8.84
  Bottom 0.178: v20.32,28.6 20.07,28.85 18.49,28.85 18.09,28.45 U$1.47 | v18.03,32.56 v20.32,32.56 | v17.2,46.3 16.94,46.05 13.67,46.02 13.41,45.77 6.91,45.77 6.65,46.02 4.75,46.02 v3.84,45.11 | v3.51,40.08 3.61,39.98 5.03,39.98 5.49,39.52 v7.16,39.52 | v3.86,26.31 7.34,26.31 v7.37,26.36 | v17.32,8.84 v16.1,8.84 16.05,8.89 v4.62,8.89
N$54  (via drill 0.41)
  Top 0.178: v10.72,13.97 10.97,14.22 10.97,20.73 10.72,20.98 v10.72,21.79
  Bottom 0.178: v10.72,13.97 U$11.P$6 | v10.72,21.79 10.01,21.79 9.3,21.08 U$1.4
VBAT  (via drill 0.41)
  Top 0.178: v9.96,18.95 9.8,19.1 9.8,19.76 8.33,21.23 7.67,21.23 7.67,21.08 7.42,20.83 7.42,17.93 7.01,17.53 v7.01,13.01 | v4.01,13.01 4.27,12.75 4.27,9.35 4.01,9.09 v4.01,6.35 4.06,6.3 4.06,4.62 4.37,4.62 U$13.P$2
  Bottom 0.178: v9.96,18.95 9.8,18.95 9.8,19.46 10.31,19.96 U$1.1 | v4.01,13.01 v7.01,13.01 | U$11.P$3 v4.01,6.35
VBUS  (via drill 0.41)
  Top 0.178: v9.8,43.33 9.8,29.82 v9.55,29.57 | v11.79,25.98 v11.79,29.57 | v12.83,25.65 12.42,25.25 12.42,21.41 12.8,21.03 v12.8,17.68 | v10.11,17.68 10.11,7.26 10.31,7.06 10.31,6.66 10.11,6.45 10.11,4.67 U$14.P$1
  Bottom 0.178: U$8.P$1 9.8,42.42 v9.8,43.33 | v11.79,29.57 v9.55,29.57 | v11.79,25.98 11.79,25.65 v12.83,25.65 | v10.11,17.68 v12.8,17.68
VDDA  (via drill 0.41)
  Top 0.178: v11.3,34.95 11.02,35.76 U$26.2 10.92,35.81 10.67,35.81 v10.67,26.75 | v9.6,22.45 C44.P$1 | v11.79,22.45 11.79,22.86 11.58,23.06 C43.P$1 | v4.55,22.84 4.67,22.71 4.67,17.12 4.98,16.82 4.98,9.35 5.23,9.09 5.23,3.35 | 5.23,3.35 v5.23,1.27 | 5.23,3.35 4.42,3.35 U$13.P$1
  Bottom 0.178: C3.P$1 v11.3,34.95 | v11.79,22.45 v9.6,22.45 9.55,22.5 9.55,23.11 7.72,24.94 | 7.72,24.94 6.81,24.94 U$1.13 6.04,24.18 5.28,23.42 5.13,23.42 v4.55,22.84 | v10.67,26.75 8.92,24.97 7.77,24.99 7.72,24.94 | v5.23,1.27 U$11.P$1
VIN  (via drill 0.41)
  Top 0.178: v5.69,40.13 5.94,40.39 5.94,44.6 5.69,44.86 v5.69,49.53
  Bottom 0.178: v5.69,40.13 U$9.P$1 | U$11.P$20 v5.69,49.53

### Text on the board
tPlace: MM4_r0